# Altium schematic sheet MCU098_01_MSPM0G3507_Target_Device.SchDoc: MSPM0G3507
size 431 x 279 mm; Date: Not shown in title block; ApprovedBy: Not shown in title block; CheckedBy: Not shown in title block; Author: Not shown in title block; CompanyName: Not shown in title block; DrawnBy: Johnson He; Engineer: Not shown in title block; Organization: Not shown in title block; Address1: Not shown in title block; Address2: Not shown in title block; Address3: Not shown in title block; Address4: Not shown in title block; DocumentNumber: 1; Revision: Use project parameter SCH_Rev; SheetNumber: 1; SheetTotal: 7; PageSetup: Record=PageOptions|CenterHorizontal=True|CenterVertical=True|PrintScale=1.00|XCorrection=1.00|YCorrection=1.00|PrintKind=0|BorderSize=5000000|LeftOffset=0|BottomOffset=0|Orientation=2|PaperLength=1000|PaperWidth=1000|Scale=100|PaperSource=15|PrintQuality=600|MediaType=1|DitherType=10|PaperKind=Letter|PrintScaleMode=1; CurrentTime: Not shown in title block; CurrentDate: Not shown in title block; Time: Not shown in title block; DocumentFullPathAndName: Not shown in title block; DocumentName: Not shown in title block; ModifiedDate: Not shown in title block; ImagePath: Not shown in title block
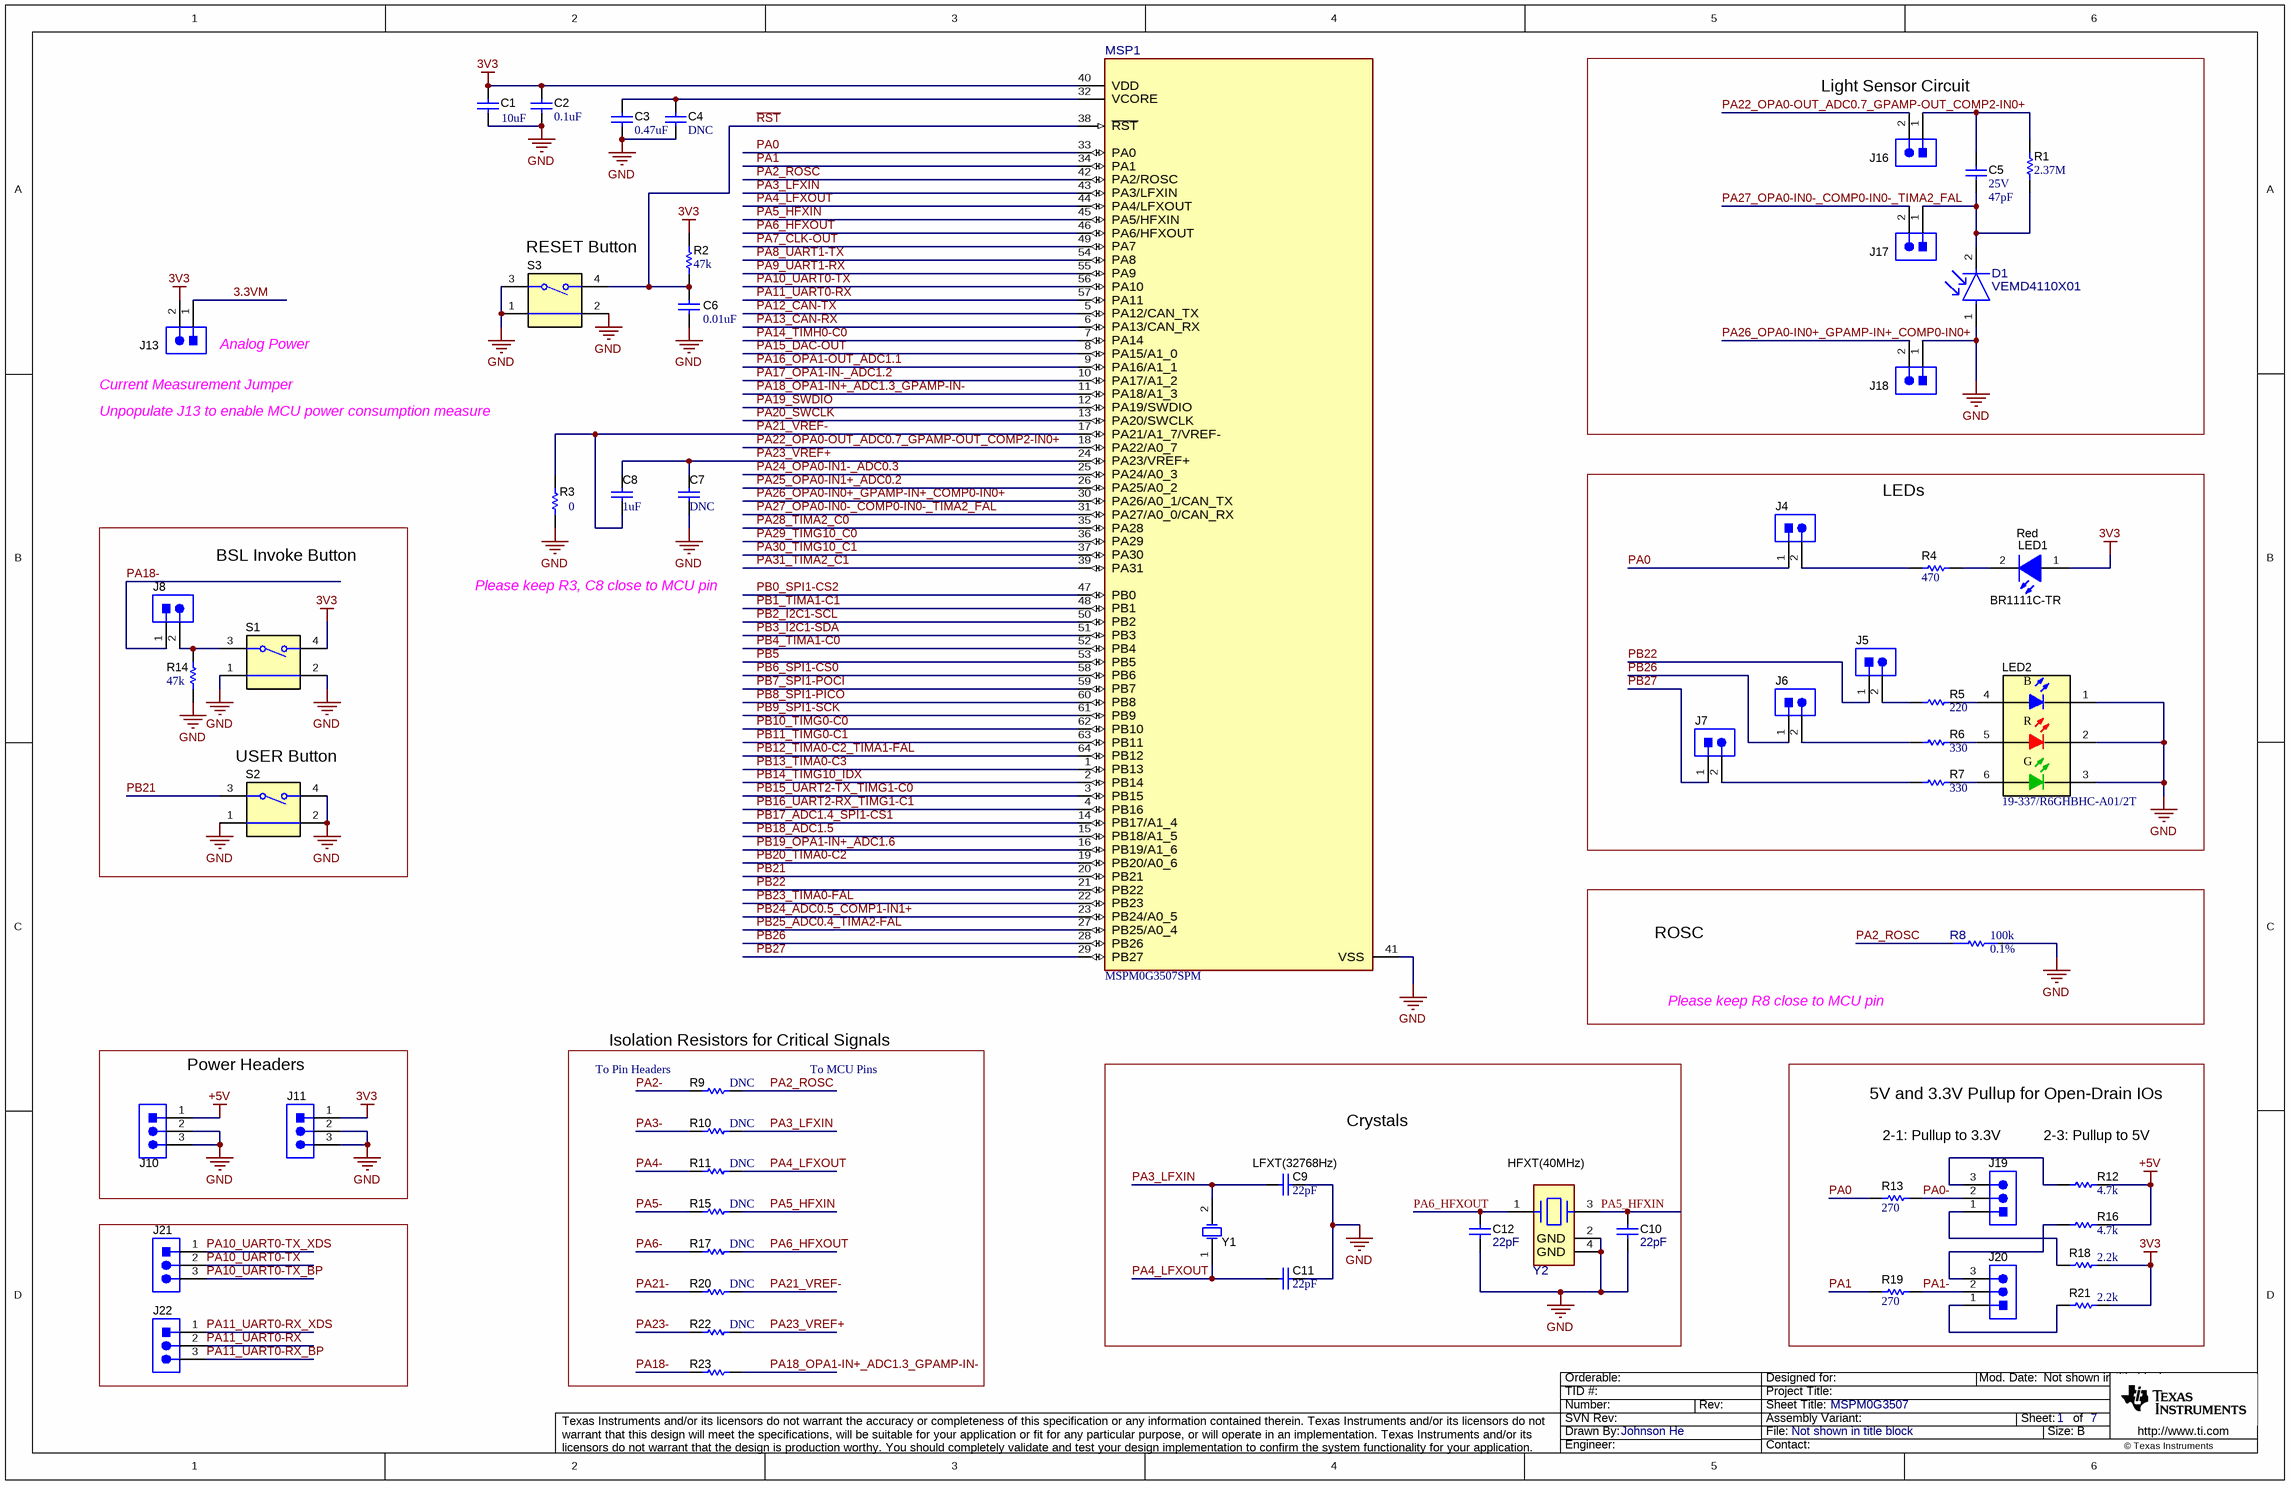
[diagram p0: MCU098_01_MSPM0G3507_Target_Device.SchDoc]

## Parts
C1  ValueDisplayed: 10uF  [0603]  (hidden comment: GRM188R60J106ME84)
C2  ValueDisplayed: 0.1uF  [0402]  (hidden comment: GRM155R61H104ME14D)
C3  ValueDisplayed: 0.47uF  [0402]  (hidden comment: GRM155R60J474KE19D)
C4  ValueDisplayed: DNC  [0402]  (hidden comment: GRM155R61H104ME14D)  (no BOM)
C5  VDC_V: 25V  ValueDisplayed: 47pF  [0402]  (hidden comment: GRM1555C1E470JA01D)
C6  ValueDisplayed: 0.01uF  [0402]  (hidden comment: GRM155R61C103KA01D)
C7  ValueDisplayed: DNC  [0603]  (hidden comment: C1608X5R1E105K080AC)  (no BOM)
C8  value 1uF  [0603]  (hidden comment: C1608X5R1E105K080AC)
C9  ValueDisplayed: 22pF  [0402]  (hidden comment: GRM1555C1H220JA01D)
C10  ValueDisplayed: 22pF  [0402]  (hidden comment: GRM1555C1H220JA01D)
C11  ValueDisplayed: 22pF  [0402]  (hidden comment: GRM1555C1H220JA01D)
C12  ValueDisplayed: 22pF  [0402]  (hidden comment: GRM1555C1H220JA01D)
D1  VEMD4110X01  [FP-VEMD4110X01_0805-MFG]
J4  90120-0122  [CONN_90120-0122]  (value not drawn)
J5  90120-0122  [CONN_90120-0122]  (value not drawn)
J6  90120-0122  [CONN_90120-0122]  (value not drawn)
J7  90120-0122  [CONN_90120-0122]  (value not drawn)
J8  90120-0122  [CONN_90120-0122]  (value not drawn)
J10  PEC03SAAN  [PEC03SAAN_Launchpad_5V0]  (value not drawn)
J11  PEC03SAAN  [PEC03SAAN_Launchpad_3V3]  (value not drawn)
J13  90120-0122  [CONN_90120-0122]  (value not drawn)
J16  90120-0122  [CONN_90120-0122]  (value not drawn)
J17  90120-0122  [CONN_90120-0122]  (value not drawn)
J18  90120-0122  [CONN_90120-0122]  (value not drawn)
J19  PEC03SAAN  [CONN_PEC03SAAN]  (value not drawn)
J20  PEC03SAAN  [CONN_PEC03SAAN]  (value not drawn)
J21  PEC03SAAN  [CONN_PEC03SAAN]  (value not drawn)
J22  PEC03SAAN  [CONN_PEC03SAAN]  (value not drawn)
LED1  BR1111C-TR  value Red  [1111C_Red]
LED2  19-337/R6GHBHC-A01/2T  [19-337_RGB]
MSP1  MSPM0G3507SPM  [PM0064A-MFG]
R1  ValueDisplayed: 2.37M  [0603]  (hidden comment: CRCW06032M37FKEA)
R2  ValueDisplayed: 47k  [0402]  (hidden comment: CRCW040247K0JNED)
R3  value 0  [0603]  (hidden comment: RC0603JR-070RL)
R4  ValueDisplayed: 470  [0402]  (hidden comment: CRCW0402470RJNED)
R5  ValueDisplayed: 220  [0402]  (hidden comment: CRCW0402220RJNED)
R6  ValueDisplayed: 330  [0402]  (hidden comment: CRCW0402330RJNED)
R7  ValueDisplayed: 330  [0402]  (hidden comment: CRCW0402330RJNED)
R8  Tolerance_%: 0.1%  Res_ohm: 100k  [FP-ERA-2AEB104X_0402-MFG]  (hidden comment: ERA-2AEB104X)
R9  ValueDisplayed: DNC  [0402]  (hidden comment: RC0402JR-070RL)  (no BOM)
R10  ValueDisplayed: DNC  [0402]  (hidden comment: RC0402JR-070RL)  (no BOM)
R11  ValueDisplayed: DNC  [0402]  (hidden comment: RC0402JR-070RL)  (no BOM)
R12  ValueDisplayed: 4.7k  [0603]  (hidden comment: RC0603JR-074K7L)
R13  ValueDisplayed: 270  [0402]  (hidden comment: CRCW0402270RJNED)
R14  ValueDisplayed: 47k  [0402]  (hidden comment: CRCW040247K0JNED)
R15  ValueDisplayed: DNC  [0402]  (hidden comment: RC0402JR-070RL)  (no BOM)
R16  ValueDisplayed: 4.7k  [0603]  (hidden comment: RC0603JR-074K7L)
R17  ValueDisplayed: DNC  [0402]  (hidden comment: RC0402JR-070RL)  (no BOM)
R18  ValueDisplayed: 2.2k  [0603]  (hidden comment: RC0603JR-0710KL)
R19  ValueDisplayed: 270  [0402]  (hidden comment: CRCW0402270RJNED)
R20  ValueDisplayed: DNC  [0402]  (hidden comment: RC0402JR-070RL)  (no BOM)
R21  ValueDisplayed: 2.2k  [0603]  (hidden comment: RC0603JR-0710KL)
R22  ValueDisplayed: DNC  [0402]  (hidden comment: RC0402JR-070RL)  (no BOM)
R23  RC0402JR-070RL  [0402]  (value not drawn)
S1  1188E-1K2-V-TR  [SW_1188E]  (value not drawn)
S2  1188E-1K2-V-TR  [SW_1188E]  (value not drawn)
S3  1188E-1K2-V-TR  [SW_1188E]  (value not drawn)
Y1  X1A0001410014  [Epson_FC-135]  (value not drawn)
Y2  X1E0000210179  [FP-X1E0000210179_TSX-3225-MFG]  (value not drawn)

## Blocks framed on the sheet
Light Sensor Circuit: C5 D1 J16-J18 R1
LEDs: J4-J7 LED1 LED2 R4-R7
ROSC: R8
Power Headers: J10 J11
Isolation Resistors for Critical Signals: R9-R11 R15 R17 R20 R22 R23
Crystals: C9-C12 Y1 Y2
5V and 3.3V Pullup for Open-Drain IOs: J19 J20 R12 R13 R16 R18 R19 R21

## Nets
3V3: C1.1 C2.1 J11.1 J13.2 LED1.1(A) MSP1.40(VDD) R2.2 R18.2 R21.2 S1.4
+5V: J10.1 R12.2 R16.2
GND: C1.2 C2.2 C3.2 C4.2 C6.2 C7.2 C9.1 C10.1 C11.1 C12.1 D1.1(ANODE) J10.2 J10.3 J11.2 J11.3 J18.1 LED2.1(K) LED2.2(K) LED2.3(K) MSP1.41(VSS) R3.1 R8.2 R14.1 S1.1 S1.2 S2.1 S2.2 S2.4 S3.1 S3.2 S3.3 Y2.2(GND) Y2.4(GND)
3.3VM: J13.1
PA0: J4.1 MSP1.33(PA0) R13.1
PA0-: J19.2 R13.2
PA1: MSP1.34(PA1) R19.1
PA1-: J20.2 R19.2
PA2-: R9.1
PA2_ROSC: MSP1.42(PA2/ROSC) R8.1 R9.2
PA3-: R10.1
PA3_LFXIN: C9.2 MSP1.43(PA3/LFXIN) R10.2 Y1.2(OSC2)
PA4-: R11.1
PA4_LFXOUT: C11.2 MSP1.44(PA4/LFXOUT) R11.2 Y1.1(OSC1)
PA5-: R15.1
PA5_HFXIN: C10.2 MSP1.45(PA5/HFXIN) R15.2 Y2.3
PA6-: R17.1
PA6_HFXOUT: C12.2 MSP1.46(PA6/HFXOUT) R17.2 Y2.1
PA7_CLK-OUT: MSP1.49(PA7)
PA8_UART1-TX: MSP1.54(PA8)
PA9_UART1-RX: MSP1.55(PA9)
PA10_UART0-TX: J21.2 MSP1.56(PA10)
PA10_UART0-TX_BP: J21.3
PA10_UART0-TX_XDS: J21.1
PA11_UART0-RX: J22.2 MSP1.57(PA11)
PA11_UART0-RX_BP: J22.3
PA11_UART0-RX_XDS: J22.1
PA12_CAN-TX: MSP1.5(PA12/CAN_TX)
PA13_CAN-RX: MSP1.6(PA13/CAN_RX)
PA14_TIMH0-C0: MSP1.7(PA14)
PA15_DAC-OUT: MSP1.8(PA15/A1_0)
PA16_OPA1-OUT_ADC1.1: MSP1.9(PA16/A1_1)
PA17_OPA1-IN-_ADC1.2: MSP1.10(PA17/A1_2)
PA18-: J8.1 R23.1
PA18_OPA1-IN+_ADC1.3_GPAMP-IN-: MSP1.11(PA18/A1_3) R23.2
PA19_SWDIO: MSP1.12(PA19/SWDIO)
PA20_SWCLK: MSP1.13(PA20/SWCLK)
PA21-: R20.1
PA21_VREF-: C8.2 MSP1.17(PA21/A1_7/VREF-) R3.2 R20.2
PA22_OPA0-OUT_ADC0.7_GPAMP-OUT_COMP2-IN0+: J16.2 MSP1.18(PA22/A0_7)
PA23-: R22.1
PA23_VREF+: C7.1 C8.1 MSP1.24(PA23/VREF+) R22.2
PA24_OPA0-IN1-_ADC0.3: MSP1.25(PA24/A0_3)
PA25_OPA0-IN1+_ADC0.2: MSP1.26(PA25/A0_2)
PA26_OPA0-IN0+_GPAMP-IN+_COMP0-IN0+: J18.2 MSP1.30(PA26/A0_1/CAN_TX)
PA27_OPA0-IN0-_COMP0-IN0-_TIMA2_FAL: J17.2 MSP1.31(PA27/A0_0/CAN_RX)
PA28_TIMA2_C0: MSP1.35(PA28)
PA29_TIMG10_C0: MSP1.36(PA29)
PA30_TIMG10_C1: MSP1.37(PA30)
PA31_TIMA2_C1: MSP1.39(PA31)
PB0_SPI1-CS2: MSP1.47(PB0)
PB1_TIMA1-C1: MSP1.48(PB1)
PB2_I2C1-SCL: MSP1.50(PB2)
PB3_I2C1-SDA: MSP1.51(PB3)
PB4_TIMA1-C0: MSP1.52(PB4)
PB5: MSP1.53(PB5)
PB6_SPI1-CS0: MSP1.58(PB6)
PB7_SPI1-POCI: MSP1.59(PB7)
PB8_SPI1-PICO: MSP1.60(PB8)
PB9_SPI1-SCK: MSP1.61(PB9)
PB10_TIMG0-C0: MSP1.62(PB10)
PB11_TIMG0-C1: MSP1.63(PB11)
PB12_TIMA0-C2_TIMA1-FAL: MSP1.64(PB12)
PB13_TIMA0-C3: MSP1.1(PB13)
PB14_TIMG10_IDX: MSP1.2(PB14)
PB15_UART2-TX_TIMG1-C0: MSP1.3(PB15)
PB16_UART2-RX_TIMG1-C1: MSP1.4(PB16)
PB17_ADC1.4_SPI1-CS1: MSP1.14(PB17/A1_4)
PB18_ADC1.5: MSP1.15(PB18/A1_5)
PB19_OPA1-IN+_ADC1.6: MSP1.16(PB19/A1_6)
PB20_TIMA0-C2: MSP1.19(PB20/A0_6)
PB21: MSP1.20(PB21) S2.3
PB22: J5.1 MSP1.21(PB22)
PB23_TIMA0-FAL: MSP1.22(PB23)
PB24_ADC0.5_COMP1-IN1+: MSP1.23(PB24/A0_5)
PB25_ADC0.4_TIMA2-FAL: MSP1.27(PB25/A0_4)
PB26: J6.1 MSP1.28(PB26)
PB27: J7.1 MSP1.29(PB27)
~{RST}: C6.1 MSP1.38(~{RST}) R2.1 S3.4
NetC3_1: C3.1 C4.1 MSP1.32(VCORE)
NetC5_1: C5.1 J16.1 R1.2
NetC5_2: C5.2 D1.2(CATHODE) J17.1 R1.1
NetJ4_2: J4.2 R4.1
NetJ5_2: J5.2 R5.1
NetJ6_2: J6.2 R6.1
NetJ7_2: J7.2 R7.1
NetJ8_2: J8.2 R14.2 S1.3
NetJ19_1: J19.1 R18.1
NetJ19_3: J19.3 R12.1
NetJ20_1: J20.1 R21.1
NetJ20_3: J20.3 R16.1
NetLED1_2: LED1.2(K) R4.2
NetLED2_4: LED2.4(A) R5.2
NetLED2_5: LED2.5(A) R6.2
NetLED2_6: LED2.6(A) R7.2

## Notes on the sheet
- (near S3) RESET Button
- (near J13) Analog Power
- (near J13) Current Measurement Jumper
- Unpopulate J13 to enable MCU power consumption measure
- BSL Invoke Button
- Please keep R3, C8 close to MCU pin
- (near S2) USER Button
- Please keep R8 close to MCU pin
- (near R9) To Pin Headers
- To MCU Pins
- (near C9) LFXT(32768Hz)
- HFXT(40MHz)
- 2-1: Pullup to 3.3V
- (near R12) 2-3: Pullup to 5V
- Drawn By:
- SVN Rev:
- Number:
- TID #:
- Orderable:
- Rev:
- Sheet Title:
- File:
- Project Title:
- Designed for:
- Assembly Variant:
- Mod. Date:
- Sheet:
- Size:
- of
- B
- http://www.ti.com
- Texas Instruments and/or its licensors do not warrant the accuracy or completeness of this specification or any information contained therein. Texas Instruments and/or its licensors do not warrant that this design will meet the specifications, will be suitable for your application or fit for any particular purpose, or will operate in an implementation. Texas Instruments and/or its licensors do not warrant that the design is production worthy. You should completely validate and test your design implementation to confirm the system functionality for your application.
- Engineer:
- Contact:
- © Texas Instruments
- (in symbol CMP-0074720-1) B; R; G

## Library data of the parts
C1 = CMP-0007304-1: CAP, CERM, 10 uF, 6.3 V, +/- 20%, X5R, 0603; Manufacturer: MuRata; TaMin_C: -55°C; Polarized: N; SizeAreaWB_mm2: 4.68; Value1: Unknown; U/M: EA; Value: 10uF; TaMax_C: 85°C; SizeZ_mm: 1; SizeX_mm: 1.6; SizeY_mm: 0.8; Value2: 6.3V; SizeArea_mm2: 1.28; Cap_F: 10µF; AEC Category: Q200; ComponentLink1URL: http://search.murata.co.jp/Ceramy/image/img/A01X/G101/ENG/GRM188R60J106ME84-01.pdf; Publisher: Texas Instruments; TempCo: X5R; Published: 2008-06-19; RoHS: Y; MountType: SMT; Supplier 1: Digi-Key; PackageReference: 0603; Tolerance_%: 20%; Cap_Case: 0603; CompType: Capacitor; LatestRevisionDate: 2017-03-09; PartNumber: GRM188R60J106ME84; AEC Qualified: ?; VDC_V: 6.3V; ComponentLink1Description: Datasheet link; Supplier Part Number 1: 490-7316-1-ND; Technology: Ceramic
C2 C4 = CMP-0006614-2: CAP, CERM, 0.1 uF, 50 V, +/- 20%, X5R, 0402; Manufacturer: MuRata; TaMin_C: -55°C; Polarized: N; SizeAreaWB_mm2: 3; Value1: Unknown; U/M: EA; Value: 0.1uF; TaMax_C: 85°C; SizeZ_mm: 0.6; SizeX_mm: 1; SizeY_mm: 0.5; Value2: 50V; Cap_F: 100nF; AEC Category: Q200; Supplier Part Number 2: 81-GRM155R61H104ME4D; Publisher: Texas Instruments; Supplier 2: Mouser; TempCo: X5R; Published: 2008-06-19; RoHS: Y; MountType: SMT; Supplier 1: Digi-Key; PackageReference: 0402; Tolerance_%: 20%; Cap_Case: 0402; SizeArea_mm2: 0.5; CompType: Capacitor; LatestRevisionDate: 2017-03-09; PartNumber: GRM155R61H104ME14D; AEC Qualified: N; VDC_V: 50V; ComponentLink1Description: Datasheet link; AEC Grade: N/A; Supplier Part Number 1: GRM155R61H104ME14D-ND; Technology: Ceramic; ComponentLink1URL: http://search.murata.co.jp/Ceramy/image/img/A01X/G101/ENG/GRM155R61H104ME14-01.pdf
C3 = CMP-0006551-2: CAP, CERM, 0.47 uF, 6.3 V, +/- 10%, X5R, 0402; Manufacturer: MuRata; TaMin_C: -55°C; Polarized: N; SizeAreaWB_mm2: 3; Value1: Unknown; U/M: EA; Value: 0.47uF; TaMax_C: 85°C; SizeZ_mm: 0.6; SizeX_mm: 1; SizeY_mm: 0.5; Value2: 6.3V; Cap_F: 470nF; AEC Category: Q200; Supplier Part Number 2: 38K1645; Publisher: Texas Instruments; Supplier 2: Newark; Supplier Part Number 3: 81-GRM155R60J474KE9D; TempCo: X5R; Supplier 3: Mouser; Published: 2008-06-19; RoHS: Y; MountType: SMT; Supplier 1: Digi-Key; PackageReference: 0402; Tolerance_%: 10%; Cap_Case: 0402; SizeArea_mm2: 0.5; CompType: Capacitor; LatestRevisionDate: 2017-03-09; PartNumber: GRM155R60J474KE19D; AEC Qualified: ?; VDC_V: 6.3V; ComponentLink1Description: Datasheet link; Supplier Part Number 1: 490-3266-1-ND; Technology: Ceramic; ComponentLink1URL: http://search.murata.co.jp/Ceramy/PnsearchViewAction.do?HnOFG=ON&HnNFG=ON&SEL_CNT=50&sLang=en&sKey=GRM155R60J474KE19D&x=9&y=9&search=startwith
C5 = CMP-0006388-2: CAP, CERM, 47 pF, 25 V, +/- 5%, C0G/NP0, 0402; Manufacturer: MuRata; TaMin_C: -55°C; Polarized: N; SizeAreaWB_mm2: 3; Value1: Unknown; U/M: EA; Value: 47pF; TaMax_C: 125°C; SizeZ_mm: 0.6; SizeX_mm: 1; SizeY_mm: 0.5; AEC Category: Q200; Publisher: Texas Instruments; TempCo: C0G/NP0; Published: 2008-06-19; RoHS: Y; MountType: SMT; Supplier 1: Mouser; PackageReference: 0402; Tolerance_%: 5%; Cap_Case: 0402; Value2: 25V; SizeArea_mm2: 0.5; CompType: Capacitor; LatestRevisionDate: 2017-03-09; PartNumber: GRM1555C1E470JA01D; AEC Qualified: ?; Cap_F: 47pF; ComponentLink1Description: Datasheet link; Supplier Part Number 1: 81-GRM1555C1E470JA1D; Technology: Ceramic; ComponentLink1URL: http://search.murata.co.jp/Ceramy/PnsearchViewAction.do?HnOFG=ON&HnNFG=ON&SEL_CNT=50&sLang=en&sKey=GRM1555C1E470JA01D&x=9&y=9&search=startwith
C6 = CMP-0006590-2: CAP, CERM, 0.01 uF, 16 V, +/- 10%, X5R, 0402; Manufacturer: MuRata; TaMin_C: -55°C; Polarized: N; SizeAreaWB_mm2: 3; Value1: Unknown; U/M: EA; Value: 0.01uF; TaMax_C: 85°C; SizeZ_mm: 0.6; SizeX_mm: 1; SizeY_mm: 0.5; Value2: 16V; Cap_F: 10nF; AEC Category: Q200; Supplier Part Number 2: 81-GRM155R61C103KA1D; Publisher: Texas Instruments; Supplier 2: Mouser; TempCo: X5R; Published: 2008-06-19; RoHS: Y; MountType: SMT; Supplier 1: Digi-Key; PackageReference: 0402; Tolerance_%: 10%; Cap_Case: 0402; SizeArea_mm2: 0.5; CompType: Capacitor; LatestRevisionDate: 2017-03-09; PartNumber: GRM155R61C103KA01D; AEC Qualified: ?; VDC_V: 16V; ComponentLink1Description: Datasheet link; Supplier Part Number 1: GRM155R61C103KA01D-ND; Technology: Ceramic; ComponentLink1URL: http://search.murata.co.jp/Ceramy/PnsearchViewAction.do?HnOFG=ON&HnNFG=ON&SEL_CNT=50&sLang=en&sKey=GRM155R61C103KA01D&x=9&y=9&search=startwith
C7 = CMP-0007006-5: CAP, CERM, 1 uF, 25 V, +/- 10%, X5R, 0603; Manufacturer: TDK; TaMin_C: -55°C; Polarized: N; SizeAreaWB_mm2: 4.68; Value1: Unknown; U/M: EA; Value: 1uF; TaMax_C: 85°C; SizeZ_mm: 1; SizeX_mm: 1.6; SizeY_mm: 0.8; Value2: 25V; SizeArea_mm2: 1.28; Cap_F: 1µF; AEC Category: Q200; Supplier Part Number 2: 90R7677; Publisher: Texas Instruments; Supplier 2: Newark; Supplier Part Number 3: 810-C1608X5R1E105K; TempCo: X5R; Supplier 3: Mouser; Published: 2008-06-19; RoHS: Y; MountType: SMT; Supplier 1: Digi-Key; PackageReference: 0603; Tolerance_%: 10%; Cap_Case: 0603; CompType: Capacitor; LatestRevisionDate: 2017-03-09; PartNumber: C1608X5R1E105K080AC; AEC Qualified: N; VDC_V: 25V; ComponentLink1Description: Datasheet link; Supplier Part Number 1: 445-5146-1-ND; Technology: Ceramic; ComponentLink1URL: https://product.tdk.com/info/en/catalog/datasheets/mlcc_commercial_general_en.pdf; AEC Grade: N/A
C8 = CMP-0007006-5: CAP, CERM, 1 uF, 25 V, +/- 10%, X5R, 0603; Manufacturer: TDK; TaMin_C: -55°C; Polarized: N; SizeAreaWB_mm2: 4.68; Value1: Unknown; U/M: EA; TaMax_C: 85°C; SizeZ_mm: 1; SizeX_mm: 1.6; SizeY_mm: 0.8; Value2: 25V; SizeArea_mm2: 1.28; Cap_F: 1µF; AEC Category: Q200; ValueDisplayed: DNC; Supplier Part Number 2: 90R7677; Publisher: Texas Instruments; Supplier 2: Newark; Supplier Part Number 3: 810-C1608X5R1E105K; TempCo: X5R; Supplier 3: Mouser; Published: 2008-06-19; RoHS: Y; MountType: SMT; Supplier 1: Digi-Key; PackageReference: 0603; Tolerance_%: 10%; Cap_Case: 0603; CompType: Capacitor; LatestRevisionDate: 2017-03-09; PartNumber: C1608X5R1E105K080AC; AEC Qualified: N; VDC_V: 25V; ComponentLink1Description: Datasheet link; Supplier Part Number 1: 445-5146-1-ND; Technology: Ceramic; ComponentLink1URL: https://product.tdk.com/info/en/catalog/datasheets/mlcc_commercial_general_en.pdf; AEC Grade: N/A
C9-C12 = CMP-0006439-2: CAP, CERM, 22 pF, 50 V, +/- 5%, C0G/NP0, 0402; Manufacturer: MuRata; TaMin_C: -55°C; Polarized: N; SizeAreaWB_mm2: 3; Value1: Unknown; U/M: EA; Value: 22pF; TaMax_C: 125°C; SizeZ_mm: 0.6; SizeX_mm: 1; SizeY_mm: 0.5; Value2: 50V; AEC Category: Q200; Publisher: Texas Instruments; TempCo: C0G/NP0; Published: 2008-06-19; RoHS: Y; MountType: SMT; Supplier 1: Mouser; PackageReference: 0402; Tolerance_%: 5%; Cap_Case: 0402; SizeArea_mm2: 0.5; CompType: Capacitor; LatestRevisionDate: 2017-03-09; PartNumber: GRM1555C1H220JA01D; AEC Qualified: ?; Cap_F: 22pF; ComponentLink1Description: Datasheet link; Supplier Part Number 1: 81-GRM1555C1H220JA1D; Technology: Ceramic; ComponentLink1URL: http://search.murata.co.jp/Ceramy/PnsearchViewAction.do?HnOFG=ON&HnNFG=ON&SEL_CNT=50&sLang=en&sKey=GRM1555C1H220JA01D&x=9&y=9&search=startwith
D1 = CMP-0093192-1: Photodiode PIN Chip 910nm Automotive 2-Pin Case 0805(2012Metric) T/R; Manufacturer: Vishay; TaMax_C: +110°C; Reverse Breakdown Voltage: 20V; AEC Qualified: Yes; TaMin_C: -40°C; Angle: 110°; Forward Current: 50mA; Vf_V: 1.1V; AEC Grade: Grade 2; Dark Current: 0.001uA; SizeZ_mm: 0.8mm; PartNumber: VEMD4110X01; LambdaD: 910nm; helpURL: https://upverter.com/upn/revision/01c27b98662013f0/; Datasheet Path: datasheets/Diode-VEMD4110X01.pdf; Operating Temperature Range: -40°C to +110°C; datasheet: https://www.vishay.com/docs/84910/vemd4110x01.pdf; Sensor Output: Photodiode; ComponentLink1Description: Datasheet; Digikey Description: PHOTO PIN DIODE IN LOW PROFILE 0; Part Number: VEMD4110X01; PackageReference: 0805; Digikey Part Number: 751-VEMD4110X01CT-ND; Lead Free: Yes; Mouser Part Number: 78-VEMD4110X01; ComponentLink1URL: https://www.vishay.com/docs/84910/vemd4110x01.pdf; RoHS: TRUE
J4-J8 J13 J16-J18 = CMP-0055312-1: Header, 100mil, 2x1, Tin, TH; Manufacturer: Molex; CNHeader: TRUE; Green_Lifecycle: Active; Green_REACh: Passed; CT: FALSE; ComponentLink1URL: http://www.molex.com/pdm_docs/sd/901200122_sd.pdf; ClassName: Header; Supplier Part Number 2: 19M8215; Publisher: Texas Instruments; Supplier 2: Newark; Supplier Part Number 3: 538-90120-0122; Supplier 3: Mouser; RoHS: Y; MountType: TH; Green_EU RoHS-2: Passed; Supplier 1: Digi-Key; Green_EU RoHS: Passed; PackageReference: Header 2x1; CompType: Header; LatestRevisionDate: 26/05/2017; PartNumber: 90120-0122; ComponentLink1Description: Datasheet URL; Supplier Part Number 1: WM8072-ND
J10 J11 J19-J22 = CMP-0002338-1: Header, 100mil, 3x1, Tin, TH; Manufacturer: Sullins Connector Solutions; CNHeader: TRUE; Current_A: 3A; Green_Lifecycle: Not Set; Shrouded: N; Gender: Male; Green_REACh: Incomplete; Voltage_V: 1.8kV; Row_Count: 1; Pitch_mm: 2.54; CT: FALSE; Cert_UL: Y; ComponentLink1URL: http://www.sullinscorp.com/catalogs/77_PAGE108-109_.100_MALE_HDR.pdf; ClassName: Header; Publisher: Texas Instruments; Color: Black; RoHS: Y; MountType: TH; Green_EU RoHS-2: Incomplete; Supplier 1: Digi-Key; Green_EU RoHS: Incomplete; PackageReference: Header, 3 PIN, 100mil, Tin; PinCount: 3; CompType: Header; LatestRevisionDate: 26/05/2017; PartNumber: PEC03SAAN; Orientation: Vertical; ComponentLink1Description: Datasheet URL; Supplier Part Number 1: S1012E-03-ND; ContactFinish: Tin
LED1 = CMP-0002972-3: LED, Red, SMD; Manufacturer: Stanley Electric Co., LTD; Power_TotalModule: 57.5mW; Vr_V: 4V; Value1: 0.0575W; Ir_A: 100µA; Io_A: 20mA; Value2: 1.7V; Tjmax_C: 85°C; RoHS: Y; Type: ?; ComponentLink1URL: https://sps06.itg.ti.com/sites/KMS/crossdivteams/altium/docs/ComponentDatasheets/BR1111C-TR.pdf; PackageReference: 1.6x0.8mm; PartNumber: BR1111C-TR; MountType: SMT; ComponentLink1Description: Datasheet link; CompType: LED; Color: Red; Vf_V: 1.7V
LED2 = CMP-0074720-1: LED, RGB, SMD; Manufacturer: Everlight; Io_A: 25mA; Vr_V: 5V; Tjmax_C: 85°C; Value1: W; U/M: EA; Angle: 120.0; Ir_A: 50µA; Vf_V: 3.8V; ComponentLink1URL: http://www.everlight.com/file/ProductFile/19-337-R6GHBHC-A01-2T.pdf; Supplier Part Number 2: 638-19337R6GHBHCA01T; Publisher: Texas Instruments; Supplier 2: Mouser; Color: RGB; Published: 2008-07-11; RoHS: Y; MountType: SMT; Value: Rgb; Supplier 1: Digi-Key; PackageReference: 1.6x1.6mm; Value2: 3.8V; CompType: LED; Type: ?; LatestRevisionDate: 2017-06-26; PartNumber: 19-337/R6GHBHC-A01/2T; ComponentLink1Description: Datasheet link; Supplier Part Number 1: 19-337/R6GHBHC-A01/2T-ND
MSP1 = CMP-0093960-1: Mixed-Signal Microcontrollers With CAN-FD Interface LQFP64; Manufacturer: Texas Instruments; Number Of I2C Channels: 2; Frequency_Fixed: 80MHz; Number Of Cores: 1; Number Of Pwm Channels: 14; Data Bus Width: 32bits; Standoff Height: 0.05mm; SizeZ_mm: 1.6mm; Number Of I/Os: 60; Memory Type: FLASH; Min Supply Voltage: 1.62V; Number Of Adc Channels: 16; Memory Size: 128KBytes; TJmax_C: +130°C; Number Of Uart Channels: 4; Number Of Timers/Counters: 7; Max Supply Voltage: 3.6V; TaMin_C: -40°C; Core Architecture: ARM Cortex-M0+; Interface: I2C,SPI,UART,CAN,LIN,IrDA,SMBus; Ram Size: 32KBytes; AEC Qualified: No; TaMax_C: +125°C; PartNumber: MSPM0G3507SPM; Number Of A/D Converters: 2; helpURL: https://upverter.com/upn/revision/bc7c7c23c86c8513/; Part Number: MSPM0G3507SPM; Number Of Spi Channels: 2; PackageReference: LQFP64; Datasheet Path: datasheets/IC-MSPM0G3507SPM.pdf; RoHS: UNKNOWN; Operating Temperature Range: -40°C to +125°C
R1 = CMP-0022292-1: RES, 2.37 M, 1%, 0.1 W, 0603; Manufacturer: Vishay-Dale; Power_W: 100mW; TempCo: 100 ppm/C; Value_Code: 2M37; U/M: EA; Value: 2.37Meg; EIA_Code: E96; SizeX_mm: 1.6; SizeY_mm: 0.8; SizeZ_mm: 1; Value2: 0.1W; SizeArea_mm2: 1.28; VDC_V: 75V; AEC Category: Q200; ComponentLink1URL: http://www.vishay.com/docs/20035/dcrcwe3.pdf; Supplier Part Number 2: 71-CRCW06032M37FKEA; Publisher: Texas Instruments; Supplier 2: Mouser; Published: 2008-06-26; RoHS: Y; Value1: 1%; MountType: SMT; Supplier 1: Digi-Key; PackageReference: 0603; Tolerance_%: 1%; Res_ohm: 2.37M; CompType: Resistor; LatestRevisionDate: 2017-03-09; PartNumber: CRCW06032M37FKEA; AEC Qualified: ?; ComponentLink1Description: Datasheet link; Supplier Part Number 1: 541-2.37MHCT-ND; Technology: Thick Film
R2 R14 = CMP-0026935-1: RES, 47 k, 5%, 0.063 W, 0402; Manufacturer: Vishay-Dale; Power_W: 63mW; TempCo: 200 ppm/C; Value_Code: 47k0; U/M: EA; Value: 47k; EIA_Code: E24; SizeX_mm: 1; SizeY_mm: 0.5; SizeZ_mm: 0.6; Value2: 0.063W; VDC_V: 50V; AEC Category: Q200; ComponentLink1URL: http://www.vishay.com/docs/20035/dcrcwe3.pdf; Supplier Part Number 2: 52K7099; Publisher: Texas Instruments; Supplier 2: Newark; Supplier Part Number 3: 71-CRCW0402-J-47K-E3; Supplier 3: Mouser; Published: 2008-06-26; RoHS: Y; Value1: 5%; MountType: SMT; Supplier 1: Digi-Key; PackageReference: 0402; Tolerance_%: 5%; Res_ohm: 47k; SizeArea_mm2: 0.5; CompType: Resistor; LatestRevisionDate: 2017-03-09; PartNumber: CRCW040247K0JNED; AEC Qualified: ?; ComponentLink1Description: Datasheet link; Supplier Part Number 1: 541-47KJCT-ND; Technology: Thick Film
R3 = CMP-0025885-5: RES, 0, 5%, 0.1 W, 0603; Manufacturer: Yageo; Power_W: 100mW; TempCo: 200 ppm/C; Value_Code: 0000; EIA_Code: E24; SizeX_mm: 1.6; SizeZ_mm: 1; Value2: 0.1W; SizeArea_mm2: 1.28; AEC Qualified: N; VDC_V: 75V; AEC Category: Q200; ValueDisplayed: DNC; SizeY_mm: 0.8; SizeAreaWB_mm2: 4.68; Supplier Part Number 2: 603-RC0603JR-070RL; Supplier 2: Mouser; Supplier Part Number 3: 9233130; Supplier 3: Farnell; RoHS: Y; Value1: 5%; MountType: SMT; Supplier 1: Digi-Key; PackageReference: 0603; Tolerance_%: 5%; Res_ohm: 0; CompType: Resistor; PartNumber: RC0603JR-070RL; ComponentLink1Description: Datasheet link; Supplier Part Number 1: 311-0.0GRCT-ND; Technology: Thick Film; ComponentLink1URL: http://www.yageo.com/pdf/Pu-RC0603_51_PbFree_L_2.pdf; AEC Grade: N/A
R4 = CMP-0026934-2: RES, 470, 5%, 0.063 W, 0402; Manufacturer: Vishay-Dale; Power_W: 63mW; TempCo: 200 ppm/C; Value_Code: 470R; U/M: EA; Value: 470; EIA_Code: E24; SizeX_mm: 1; SizeY_mm: 0.5; SizeZ_mm: 0.6; Value2: 0.063W; VDC_V: 50V; AEC Category: Q200; Supplier Part Number 2: 59M6737; Publisher: Texas Instruments; Supplier 2: Newark; Supplier Part Number 3: 71-CRCW0402J-470-E3; Supplier 3: Mouser; Published: 2008-06-26; RoHS: Y; Value1: 5%; MountType: SMT; Supplier 1: Digi-Key; PackageReference: 0402; Tolerance_%: 5%; Res_ohm: 470; SizeArea_mm2: 0.5; CompType: Resistor; LatestRevisionDate: 2017-03-09; PartNumber: CRCW0402470RJNED; AEC Qualified: ?; ComponentLink1Description: Datasheet link; Supplier Part Number 1: 541-470JCT-ND; Technology: Thick Film; ComponentLink1URL: http://www.vishay.com/docs/20035/dcrcwe3.pdf
R5 = CMP-0026878-1: RES, 220, 5%, 0.063 W, 0402; Manufacturer: Vishay-Dale; Power_W: 63mW; TempCo: 200 ppm/C; Value_Code: 220R; U/M: EA; Value: 220; EIA_Code: E24; SizeX_mm: 1; SizeY_mm: 0.5; SizeZ_mm: 0.6; Value2: 0.063W; VDC_V: 50V; AEC Category: Q200; ComponentLink1URL: http://www.vishay.com/docs/20035/dcrcwe3.pdf; Supplier Part Number 2: 59M6718; Publisher: Texas Instruments; Supplier 2: Newark; Supplier Part Number 3: 71-CRCW0402J-220-E3; Supplier 3: Mouser; Published: 2008-06-26; RoHS: Y; Value1: 5%; MountType: SMT; Supplier 1: Digi-Key; PackageReference: 0402; Tolerance_%: 5%; Res_ohm: 220; SizeArea_mm2: 0.5; CompType: Resistor; LatestRevisionDate: 2017-03-09; PartNumber: CRCW0402220RJNED; AEC Qualified: ?; ComponentLink1Description: Datasheet link; Supplier Part Number 1: 541-220JCT-ND; Technology: Thick Film
R6 R7 = CMP-0026906-1: RES, 330, 5%, 0.063 W, 0402; Manufacturer: Vishay-Dale; Power_W: 63mW; TempCo: 200 ppm/C; Value_Code: 330R; U/M: EA; Value: 330; EIA_Code: E24; SizeX_mm: 1; SizeY_mm: 0.5; SizeZ_mm: 0.6; Value2: 0.063W; VDC_V: 50V; AEC Category: Q200; ComponentLink1URL: http://www.vishay.com/docs/20035/dcrcwe3.pdf; Supplier Part Number 2: 59M6728; Publisher: Texas Instruments; Supplier 2: Newark; Supplier Part Number 3: 71-CRCW0402J-330-E3; Supplier 3: Mouser; Published: 2008-06-26; RoHS: Y; Value1: 5%; MountType: SMT; Supplier 1: Digi-Key; PackageReference: 0402; Tolerance_%: 5%; Res_ohm: 330; SizeArea_mm2: 0.5; CompType: Resistor; LatestRevisionDate: 2017-03-09; PartNumber: CRCW0402330RJNED; AEC Qualified: ?; ComponentLink1Description: Datasheet link; Supplier Part Number 1: 541-330JCT-ND; Technology: Thick Film
R8 = CMP-0088648-1: Res Thin Film 0402 100K Ohm 0.1% 1/16W ±25ppm/°C Molded SMD SMD Punched Carrier T/R; Manufacturer: Panasonic; Category 7542B8484461Ae85: Passive Components; VDC_V: 50V; Category Cd01000Bfc2916C6: Single Components; Power_W: 63mW; Category 5A00970A6D5C81C7: Uncategorized; AEC Qualified: Yes; SizeZ_mm: 0.4mm; Voltage: 25V; AEC Grade: Grade 0; Category 5C6A91606D4187Ad: Resistors; Lead Free: Yes; Supplier 1: Digikey; datasheet: https://industrial.panasonic.com/cdbs/www-data/pdf/RDM0000/AOA0000C307.pdf; PackageReference: 0402; Operating Temperature Range: -55°C to +155°C; Digikey Part Number: P100KDCCT-ND; Datasheet Path: datasheets/Res-ERA-2AEB104X.pdf; RoHS: TRUE; Supplier Part Number 2: 667-ERA-2AEB104X; PartNumber: ERA-2AEB104X; TempCo: 25ppm/°C; ComponentLink1Description: Datasheet; ComponentLink1URL: https://industrial.panasonic.com/cdbs/www-data/pdf/RDM0000/AOA0000C307.pdf; Supplier Part Number 1: P100KDCCT-ND; Technology: Thin Film; Series: ERA; Mouser Description: Res Thin Film 0402 100K Ohm 0.1% 0.063W ±25ppm/°C Molded SMD Punched Carrier T/R; Octopart Part Number: aea26725a1f47165; Mouser Part Number: 667-ERA-2AEB104X; Supplier 2: Mouser; Part Number: ERA-2AEB104X; helpURL: https://upverter.com/upn/revision/e235bfb49dac4d4c/; Digikey Description: RES SMD 100K OHM 0.1% 1/16W 0402
R9-R11 R15 R17 R20 R22 R23 = CMP-0027004-2: RES, 0, 5%, 0.063 W, 0402; Manufacturer: Yageo America; Power_W: 63mW; TempCo: 200 ppm/C; Value_Code: 0000; U/M: EA; Value: 0; EIA_Code: E24; SizeX_mm: 1; SizeY_mm: 0.5; SizeZ_mm: 0.6; Value2: 0.063W; VDC_V: 50V; AEC Category: Q200; Supplier Part Number 2: 603-RC0402JR-070RL; Publisher: Texas Instruments; Supplier 2: Mouser; Supplier Part Number 3: 9232516; Supplier 3: Farnell; Published: 2008-06-26; RoHS: Y; Value1: 5%; MountType: SMT; Supplier 1: Digi-Key; PackageReference: 0402; Tolerance_%: 5%; Res_ohm: 0; SizeArea_mm2: 0.5; CompType: Resistor; LatestRevisionDate: 2017-03-09; PartNumber: RC0402JR-070RL; AEC Qualified: ?; ComponentLink1Description: Datasheet link; Supplier Part Number 1: 311-0.0JRCT-ND; Technology: Thick Film; ComponentLink1URL: http://www.yageo.com/pdf/Pu-RC0402_51_PbFree_L_2.pdf
R12 R16 = CMP-0025927-5: RES, 4.7 k, 5%, 0.1 W, 0603; Manufacturer: Yageo; Power_W: 100mW; TempCo: 100 ppm/C; Value_Code: 4k70; Value: 4.7k; EIA_Code: E24; SizeX_mm: 1.6; SizeY_mm: 0.8; SizeZ_mm: 1; Value2: 0.1W; SizeArea_mm2: 1.28; AEC Qualified: N; VDC_V: 75V; AEC Category: Q200; SizeAreaWB_mm2: 4.68; Supplier Part Number 2: 603-RC0603JR-074K7L; Supplier 2: Mouser; Supplier Part Number 3: 9233466; Supplier 3: Farnell; RoHS: Y; Value1: 5%; MountType: SMT; Supplier 1: Digi-Key; PackageReference: 0603; Tolerance_%: 5%; Res_ohm: 4.7k; CompType: Resistor; PartNumber: RC0603JR-074K7L; ComponentLink1Description: Datasheet link; Supplier Part Number 1: 311-4.7KGRCT-ND; Technology: Thick Film; ComponentLink1URL: http://www.yageo.com/pdf/Pu-RC0603_51_PbFree_L_2.pdf; AEC Grade: N/A
R13 R19 = CMP-0026886-1: RES, 270, 5%, 0.063 W, 0402; Manufacturer: Vishay-Dale; Power_W: 63mW; TempCo: 200 ppm/C; Value_Code: 270R; U/M: EA; Value: 270; EIA_Code: E24; SizeX_mm: 1; SizeY_mm: 0.5; SizeZ_mm: 0.6; Value2: 0.063W; VDC_V: 50V; AEC Category: Q200; ComponentLink1URL: http://www.vishay.com/docs/20035/dcrcwe3.pdf; Supplier Part Number 2: 59M6722; Publisher: Texas Instruments; Supplier 2: Newark; Supplier Part Number 3: 71-CRCW0402J-270-E3; Supplier 3: Mouser; Published: 2008-06-26; RoHS: Y; Value1: 5%; MountType: SMT; Supplier 1: Digi-Key; PackageReference: 0402; Tolerance_%: 5%; Res_ohm: 270; SizeArea_mm2: 0.5; CompType: Resistor; LatestRevisionDate: 2017-03-09; PartNumber: CRCW0402270RJNED; AEC Qualified: ?; ComponentLink1Description: Datasheet link; Supplier Part Number 1: 541-270JCT-ND; Technology: Thick Film
R18 R21 = CMP-0025906-5: RES, 2.2 k, 5%, 0.1 W, 0603; PartNumber: RC0603JR-072K2L; Manufacturer: Yageo; Power_W: 100mW; TempCo: 100 ppm/C; Value_Code: 2k20; Value: 2.2k; EIA_Code: E24; SizeX_mm: 1.6; SizeY_mm: 0.8; SizeZ_mm: 1; Value2: 0.1W; SizeArea_mm2: 1.28; VDC_V: 75V; SizeAreaWB_mm2: 4.68; AEC Qualified: N; AEC Category: Q200; Supplier Part Number 2: 603-RC0603JR-072K2L; Supplier 2: Mouser; Supplier Part Number 3: 9233423; Supplier 3: Farnell; RoHS: Y; Value1: 5%; MountType: SMT; Tolerance_%: 5%; Res_ohm: 2.2k; CompType: Resistor; ComponentLink1Description: Datasheet link; Supplier Part Number 1: 311-2.2KGRCT-ND; ComponentLink1URL: http://www.yageo.com/pdf/Pu-RC0603_51_PbFree_L_2.pdf; Supplier 1: Digi-Key; PackageReference: 0603; Technology: Thick Film; AEC Grade: N/A
S1-S3 = CMP-0002328-1: Switch, SPST, 0.05 A, 12 VDC, SMD; Manufacturer: Diptronics; CurrentRating_mA: 50A; PositionCount: 1; SizeX_mm: 7.8; SizeY_mm: 3.5; SizeArea_mm2: 27.3; VDC_V: 12V; SizeAreaWB_mm2: 53.9; PartNumber: 1188E-1K2-V-TR; ComponentLink1Description: Datasheet URL; LatestRevisionDate: 2017-03-09; ComponentLink1URL: http://www.dip.com.tw/en/en-product-information/en-switch004/item/download/1976_b080c057386714e3a6604cbe658b9df3; CompType: Switch; PackageReference: 7.8x3.5mm; SizeZ_mm: 3.5; Publisher: Texas Instruments; Circuit: SPST; RoHS: Y; Orientation: Side Actuated; MountType: SMT
Y1 = CMP-0004693-2: Crystal, 32.768 KHz, 12.5 pF, SMD; Manufacturer: Epson; TaMax_C: 85°C; TaMin_C: -40°C; U/M: EA; Publisher: Texas Instruments; CompType: Crystal; PackageReference: SMD, 2-Leads, Body 3.2x1.5mm; LatestRevisionDate: 18/04/2017; RoHS: Y; MountType: SMT; Frequency_Fixed: 32.768kHz; PartNumber: X1A0001410014; ComponentLink1Description: Datasheet Link; ComponentLink1URL: https://support.epson.biz/td/api/doc_check.php?dl=brief_FC-135R_en.pdf
Y2 = CMP-0098168-2: Crystal 40MHz ±10ppm (Tol) ±20ppm (Stability) 12pF FUND 40Ohm 4-Pin Mini-CSMD T/R; Manufacturer: Seiko Epson; SizeZ_mm: 0.6mm; AEC Qualified: No; Esr: 40; Frequency Stability: 20ppm; RoHS: TRUE; Frequency_Fixed: 40MHz; PackageReference: TSX-3225; PartNumber: X1E0000210179; ComponentLink1Description: Datasheet; ComponentLink1URL: https://support.epson.biz/td/api/doc_check.php?mode=dl&lang=en&Parts=X1E0000210179; datasheet: https://support.epson.biz/td/api/doc_check.php?mode=dl&lang=en&Parts=X1E0000210179; Datasheet Path: datasheets/Crys-X1E0000210179.pdf; Frequency Tolerance: 10ppm; helpURL: https://upverter.com/upn/revision/08d7803d4c2c7fb7/; Lead Free: Yes; Load Capacitance: 12pF; Operating Temperature Range: -40°C to +105°C; Part Number: X1E0000210179; Series: TSX-3225; Tolerance_%: 10ppm